# EAGLE design MeshSync (EAGLE 6.1)
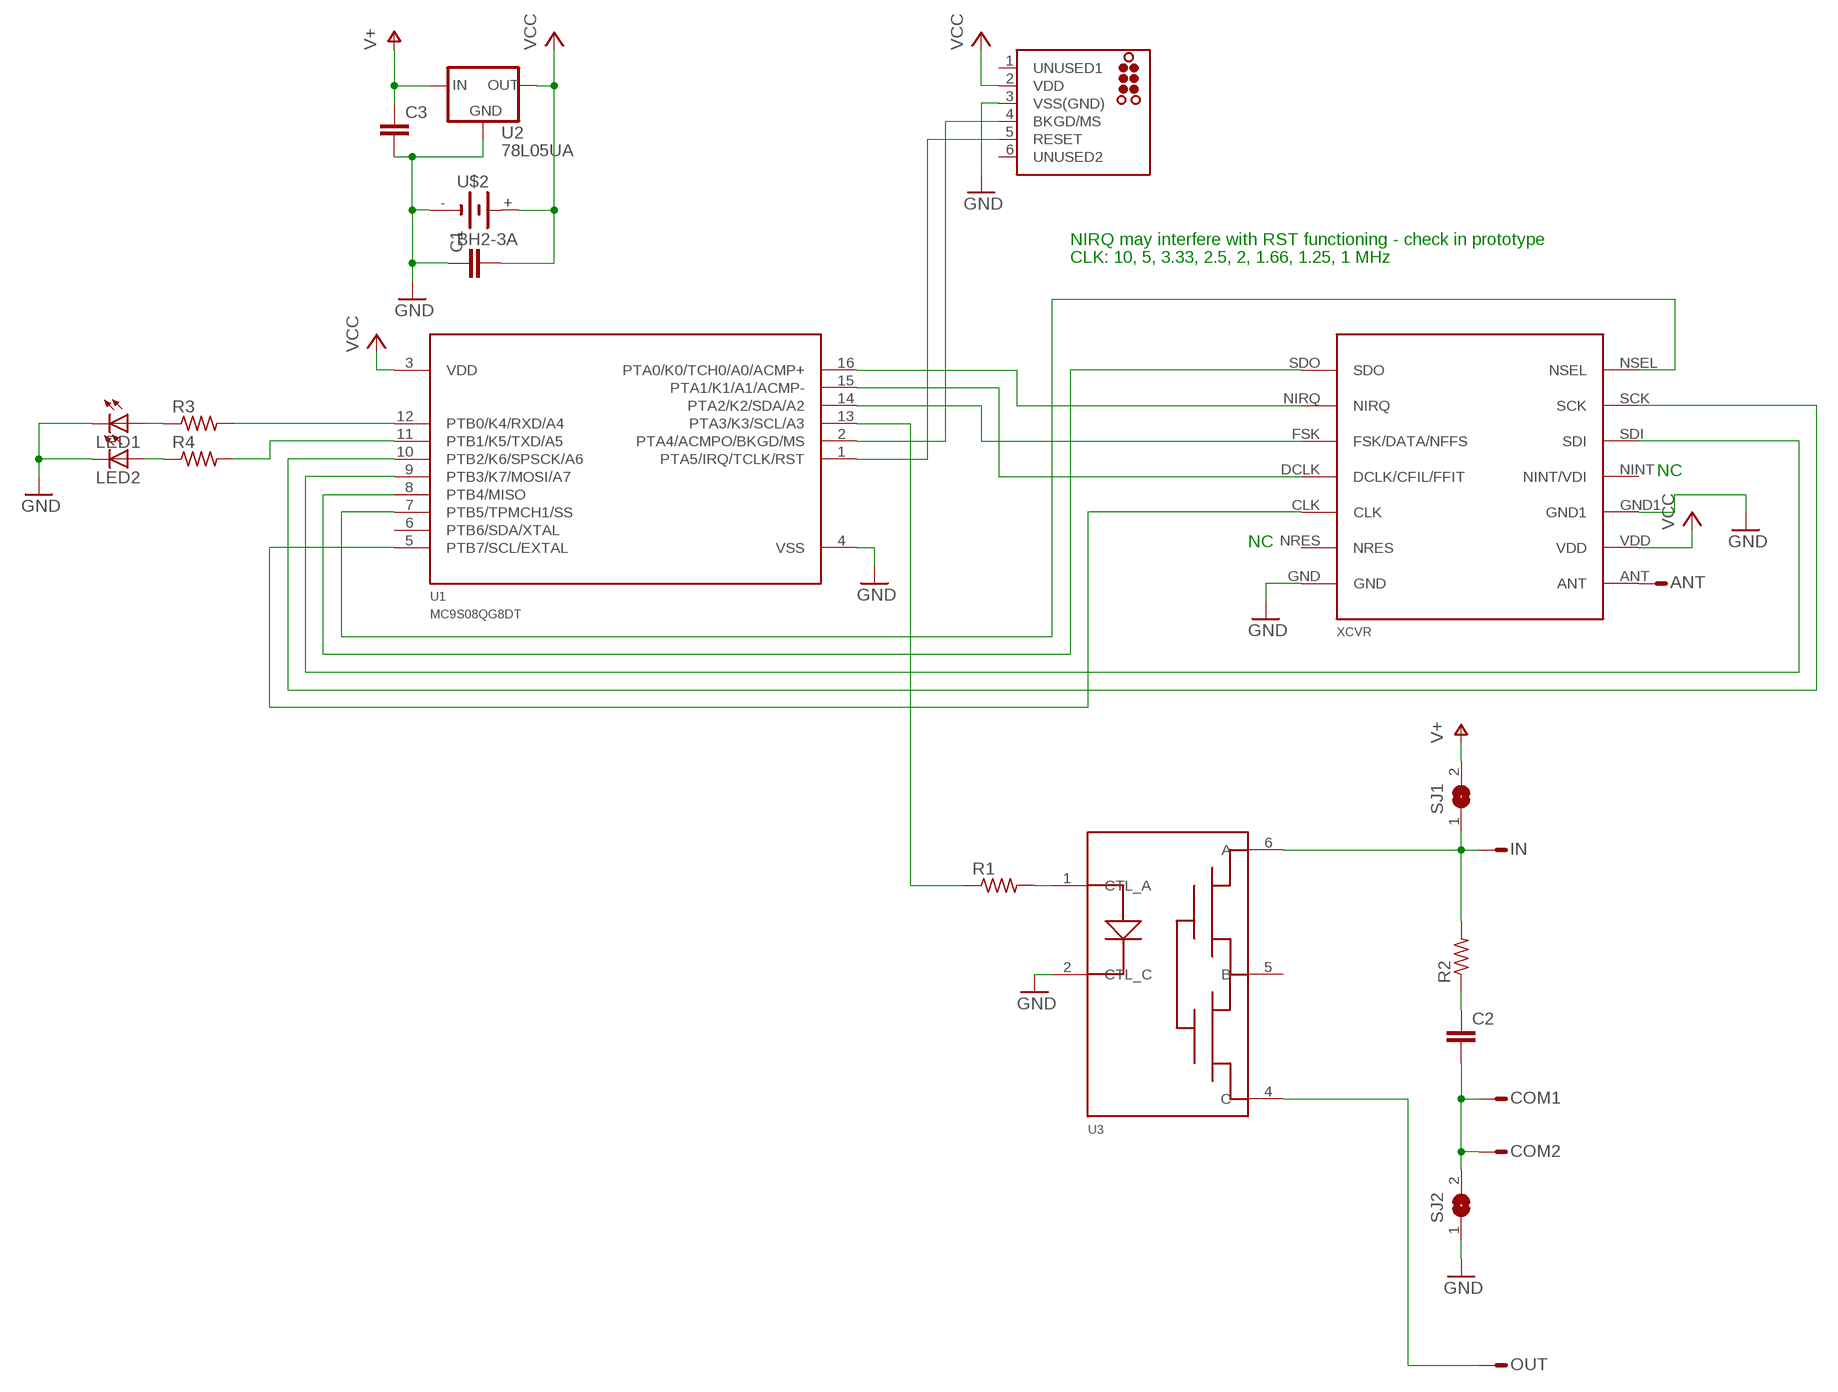
[diagram p0: schematic, sheet 1]

## Parts
ANT  PIN  [PINHEAD-1]
C1  C-EUC0805K  [C0805K]
C2  C-EUC0603K  [C0603K]
C3  C-EUC0603K  [C0603K]
COM1  PIN  [PINHEAD-1]
COM2  PIN  [PINHEAD-1]
IN  PIN  [PINHEAD-1]
LED1  LEDCHIPLED_0603  [CHIPLED_0603]
LED2  LEDCHIPLED_0603  [CHIPLED_0603]
OUT  PIN  [PINHEAD-1]
R1  R0603  [R0603]
R2  R0603  [R0603]
R3  R0603  [R0603]
R4  R0603  [R0603]
SJ1  SJW  [SJW]
SJ2  SJW  [SJW]
U1  MC9S08QG8DT  [TSSOP16]
U2  78L05UA  [SOT89]
U3  PVT312  [DIL06-SMT]
U$1  TC2030-MCP-NL  [TC2030-MCP-NL]
U$2  BH2-3A  [BH2-3A]
XCVR  RFM12B  [RFM12B]

## Nets
GND: C1.1 C3.2 LED1.C LED2.C SJ2.1 U1.4(VSS) U2.2(GND) U3.2(CTL_C) U$1.3(VSS(GND)) U$2.- XCVR.GND XCVR.GND1
N$1: U1.2(PTA4/ACMPO/BKGD/MS) U$1.4(BKGD/MS)
N$2: U1.1(PTA5/IRQ/TCLK/RST) U$1.5(RESET)
N$3: R1.2 U3.1(CTL_A)
N$4: U1.8(PTB4/MISO) XCVR.SDO
N$5: U1.9(PTB3/K7/MOSI/A7) XCVR.SDI
N$6: U1.10(PTB2/K6/SPSCK/A6) XCVR.SCK
N$7: U1.7(PTB5/TPMCH1/SS) XCVR.NSEL
N$8: U1.16(PTA0/K0/TCH0/A0/ACMP+) XCVR.NIRQ
N$9: U1.5(PTB7/SCL/EXTAL) XCVR.CLK
N$10: U1.15(PTA1/K1/A1/ACMP-) XCVR.DCLK(DCLK/CFIL/FFIT)
N$11: U1.14(PTA2/K2/SDA/A2) XCVR.FSK(FSK/DATA/NFFS)
N$12: ANT.1(M) XCVR.ANT
N$13: R1.1 U1.13(PTA3/K3/SCL/A3)
N$14: IN.1(M) R2.2 SJ1.1 U3.6(A)
N$15: OUT.1(M) U3.4(C)
N$16: C2.1 R2.1
N$17: C2.2 COM1.1(M) COM2.1(M) SJ2.2
N$18: R4.2 U1.11(PTB1/K5/TXD/A5)
N$19: R3.2 U1.12(PTB0/K4/RXD/A4)
N$20: LED1.A R3.1
N$21: LED2.A R4.1
V+: C3.1 SJ1.2 U2.3(IN)
VCC: C1.2 U1.3(VDD) U2.1(OUT) U$1.2(VDD) U$2.+ XCVR.VDD
Unconnected: U1.6(PTB6/SDA/XTAL) U3.5(B) U$1.1(UNUSED1) U$1.6(UNUSED2) XCVR.NINT(NINT/VDI) XCVR.NRES

## Notes on the sheet
- NIRQ may interfere with RST functioning - check in prototype
- CLK: 10, 5, 3.33, 2.5, 2, 1.66, 1.25, 1 MHz
- NC
- NC

## Library data of the parts
ANT COM1 COM2 IN OUT = scott:PIN
C1-C3 = rcl:C-EU: CAPACITOR, European symbol
LED1 LED2 = led:LED: LED OSRAM: - CHIPLED LG R971, LG N971, LY N971, LG Q971, LY Q971, LO R971, LY R971 LH N974, LH R974 LS Q976, LO Q976, LY Q976 LO Q996 - Hyper CHIPLED LW Q18S LB Q993, LB Q99A, LB R99A - SideLED LS A670, LO A670, LY A670, LG A670, LP A670 LB A673, LV A673, LT A673, LW A673 LH A674 LY A675 LS A676, LA A676, LO A676, LY A676, LW A676 LS A679, LY A679, LG A679 - Hyper Micro SIDELED® LS Y876, LA Y876, LO Y876, LY Y876 LT Y87S - SmartLED LW L88C, LW L88S LB L89C, LB L89S, LG L890 LS L89K, LO L89K, LY L89K LS L896, LA L896, LO L896, LY L896 - TOPLED LS T670, LO T670, LY T670, LG T670, LP T670 LSG T670, LSP T670, LSY T670, LOP T670, LYG T670 LG T671, LOG T671, LSG T671 LB T673, LV T673, LT T673, LW T673 LH T674 LS T676, LA T676, LO T676, LY T676, LB T676, LH T676, LSB T676, LW T676 LB T67C, LV T67C, LT T67C, LS T67K, LO T67K, LY T67K, LW E67C LS E67B, LA E67B, LO E67B, LY E67B, LB E67C, LV E67C, LT E67C LW T67C LS T679, LY T679, LG T679 LS T770, LO T770, LY T770, LG T770, LP T770 LB T773, LV T773, LT T773, LW T773 LH T774 LS E675, LA E675, LY E675, LS T675 LS T776, LA T776, LO T776, LY T776, LB T776 LHGB T686 LT T68C, LB T68C - Hyper Mini TOPLED® LB M676 - Mini TOPLED Santana® LG M470 LS M47K, LO M47K, LY M47K Source: http://www.osram.convergy.de LUXEON: - LUMILED® LXK2-PW12-R00, LXK2-PW12-S00, LXK2-PW14-U00, LXK2-PW14-V00 LXK2-PM12-R00, LXK2-PM12-S00, LXK2-PM14-U00 LXK2-PE12-Q00, LXK2-PE12-R00, LXK2-PE12-S00, LXK2-PE14-T00, LXK2-PE14-U00 LXK2-PB12-K00, LXK2-PB12-L00, LXK2-PB12-M00, LXK2-PB14-N00, LXK2-PB14-P00, LXK2-PB14-Q00 LXK2-PR12-L00, LXK2-PR12-M00, LXK2-PR14-Q00, LXK2-PR14-R00 LXK2-PD12-Q00, LXK2-PD12-R00, LXK2-PD12-S00 LXK2-PH12-R00, LXK2-PH12-S00 LXK2-PL12-P00, LXK2-PL12-Q00, LXK2-PL12-R00 Source: www.luxeon.com KINGBRIGHT: KA-3528ASYC Source: www.kingbright.com
R1-R4 = scott:R0603
SJ1 SJ2 = jumper:SJ: SMD solder JUMPER
U1 = scott:MC9S08QG8
U2 = scott:78L05
U3 = scott:PVT312
U$1 = scott:TC2030: TAG-CONNECT ISP Connector Manufacturer: Tag-Connect <www.tag-connect.com> Cable for easy In-Circuit PCB Programming. Designed for Microchip ICD2, suitable for many others. Two variants - one "with legs" (for hads-free fit on PCB) and another "without legs" for quick programming. PAD Description 1 MCLR/Vpp 2 Vdd 3 GND 4 PGD (ISPDAT) 5 PGC (ISPCLK) 6 nc (used for LVP) ©2009 ROFA.cz
U$2 = scott:BH2-3A
XCVR = scott:RFM12B: ISM band transceiver. 2.2 to 3.8v supply.

## Board
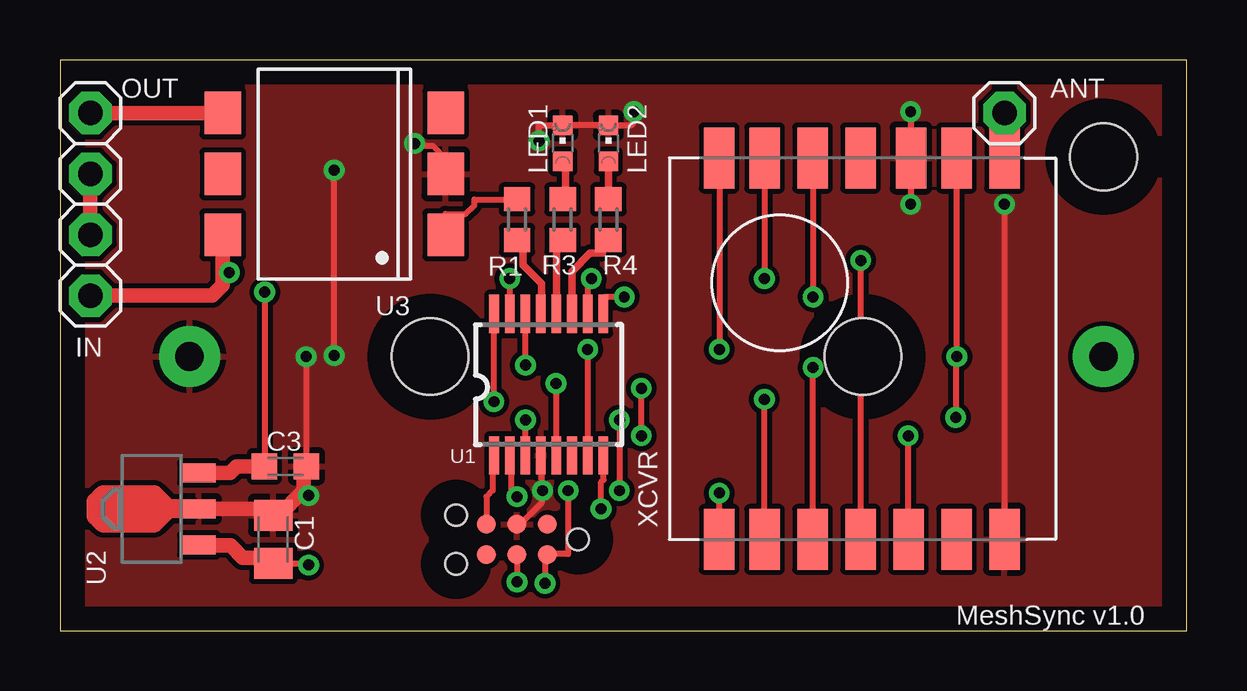
[diagram p1: board, top side]
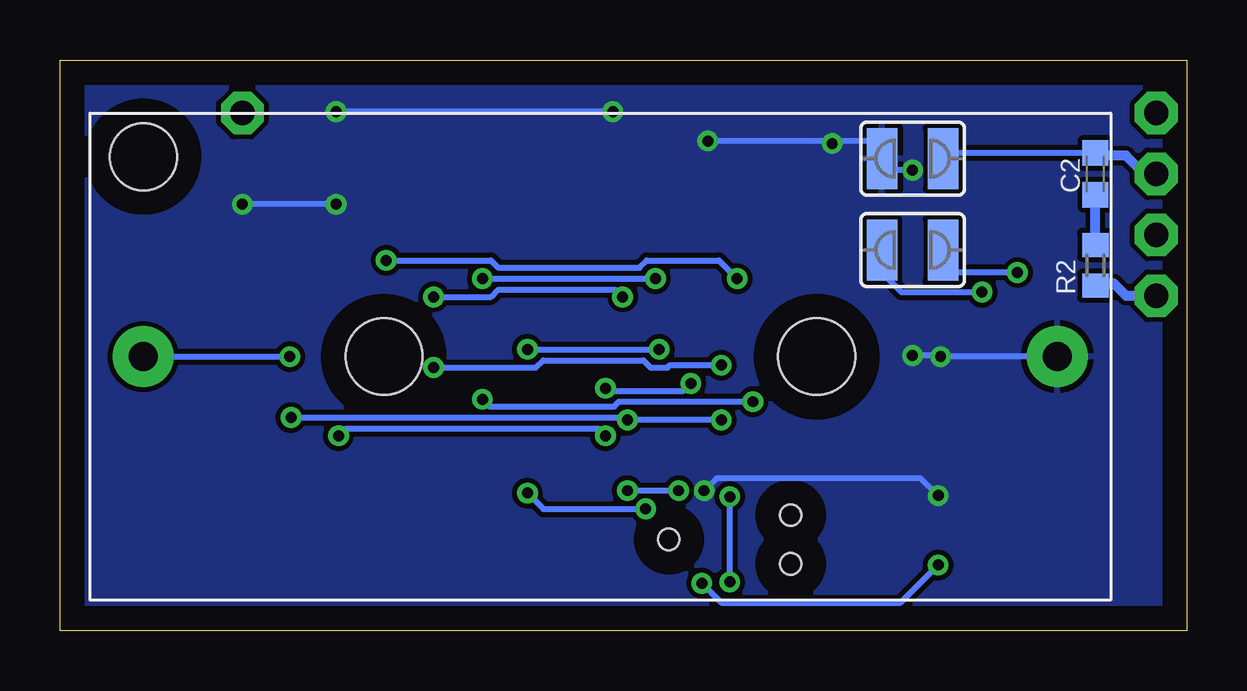
[diagram p2: board, bottom side, seen from below]

Size 46.97 x 23.8 mm. Coordinates in mm from the lower left corner, seen from the top.
Outline: 0,0 46.97,0 46.97,23.8 0,23.8 0,0
Copper layers (1*16): Top 0.035mm / dielectric 1.5mm / Bottom 0.035mm
Design rules: minimum track width 10mil, minimum drill 18mil, track to track 8mil, track to pad 8mil, pad to pad 8mil, via to via 8mil, smd to smd 8mil, copper to edge 40mil, drill to drill 8mil, minimum pad ring 10mil, minimum via ring 8mil, stop-mask expansion 4mil, vias tented up to drill 19mil, thermal gap 10mil

### Footprints (pad centres in the part's own frame; a part is rotated, then mirrored left to right if it is on the bottom)
PINHEAD-1 = drill 1.016 pad 1.778 octagon: 1 0,0
C0805K = smd 1.3 x 1.6: 1 -1,0; 2 1,0
C0603K = smd 1.05 x 1.08: 1 -0.875,0; 2 0.875,0
CHIPLED_0603 = smd 0.8 x 0.8: A 0,-0.75; C 0,0.75
R0603 = smd 1 x 1.1: 1 -0.85,0; 2 0.85,0
SJW = smd 1.27 x 2.54: 1 -1.27,0; 2 1.27,0
TSSOP16 = smd 0.4 x 1.6: 1 -2.225,-2.85; 2 -1.575,-2.85; 3 -0.925,-2.85; 4 -0.275,-2.85; 5 0.375,-2.85; 6 1.025,-2.85; 7 1.675,-2.85; 8 2.325,-2.85; 9 2.325,3.05; 10 1.675,3.05; 11 1.025,3.05; 12 0.375,3.05; 13 -0.275,3.05; 14 -0.925,3.05; 15 -1.575,3.05; 16 -2.225,3.05
SOT89 = smd 0.8 x 1.4: 1 -1.499,-1.981; 2 0,-1.981; 3 1.499,-1.981
DIL06-SMT = smd 1.78 x 1.52: 1 -2.54,-4.645; 2 0,-4.645; 3 2.54,-4.645; 4 2.54,4.645; 5 0,4.645; 6 -2.54,4.645
TC2030-MCP-NL = smd 0.787 x 0.787: 1 1.27,-0.635; 2 1.27,0.635; 3 2.54,-0.635; 4 2.54,0.635; 5 3.81,-0.635; 6 3.81,0.635 | hole 0.889: 0,0; 5.08,-1.016; 5.08,1.016
BH2-3A = drill 1.2 pad 2.54: + 18.098,0; - -20.003,0 | hole 3.2: -9.97,0; 8.065,0 | hole 2.8: 18.098,-8.331
RFM12B = smd 1.27 x 2.54: ANT 13.97,15.9; CLK 9.97,0; DCLK 7.97,0; FSK 5.97,0; GND 13.97,0; GND1 10.07,15.9; NINT 7.97,15.9; NIRQ 3.97,0; NRES 11.97,0; NSEL 2.07,15.9; SCK 3.97,15.9; SDI 5.97,15.9; SDO 2.07,0; VDD 11.97,15.9

### Placement (x,y rotation side)
ANT  39.37,21.59 0 top
C1  8.89,3.81 270 top
C2  3.81,19.05 90 bottom
C3  9.4,6.86 0 top
COM1  1.27,19.05 0 top
COM2  1.27,16.51 0 top
IN  1.27,13.97 0 top
LED1  20.95,20.32 0 top
LED2  22.86,20.32 0 top
OUT  1.27,21.59 0 top
R1  19.05,17.14 90 top
R2  3.81,15.24 270 bottom
R3  20.95,17.14 270 top
R4  22.86,17.14 270 top
SJ1  11.43,15.88 180 bottom
SJ2  11.43,19.68 0 bottom
U1  20.32,10.16 0 top
U2  3.81,5.08 90 top
U3  11.43,19.05 90 top
U$1  21.59,3.81 180 top
U$2  25.4,11.43 180 bottom
XCVR  25.4,3.81 0 top

### Tracks (layer width: path | path; a pad name or v marks a point on that pad's centre or on a via)
GND  (via drill 0.46)
  Top 0.254: U$1.3 19.05,4.32 20.07,5.33 20.07,5.84 | 20.07,5.84 20.07,7.11 U1.4 | v39.37,17.78 XCVR.GND | v35.46,17.78 35.46,19.66 XCVR.GND1 35.46,19.81 v35.46,21.64 | v19.96,20.42 19.96,21.08 20.83,21.08 LED1.C 20.98,21.08 22.86,21.08 LED2.C 22.96,21.08 23.82,21.08 23.88,21.13 23.88,21.59 v23.93,21.64 | v14.78,20.32 14.78,20.22 15.54,20.22 16.05,19.71 16.05,19.05 U3.2 | v20.12,5.84 20.07,5.84 | v10.36,5.64 10.16,5.84 | v10.26,11.43 10.26,7.11 C3.2 | v11.43,11.48 v11.43,19.2
  Top 0.61: U2.2 8.89,5.08 C1.1 9.13,4.81 10.16,5.84 10.16,6.86 C3.2
  Bottom 0.254: v35.46,17.78 v39.37,17.78 | 14.78,20.42 12.75,20.42 12.7,20.37 SJ2.1 12.7,19.2 v11.43,19.2 | 14.78,20.42 v19.96,20.42 | v14.78,20.32 14.78,20.42 | v20.12,5.84 19.61,6.35 11.07,6.35 v10.36,5.64 | U$2.- v10.26,11.43 10.36,11.48 v11.43,11.48 | v23.93,21.64 v35.46,21.64
  pour Top: 0.25,23.62 46.74,23.62 46.74,0.25 0.25,0.25
  pour Bottom: 0.25,23.62 46.74,23.62 46.74,0.25 0.25,0.25
N$1  (via drill 0.46)
  Top 0.254: U1.2 18.8,7.11 18.8,5.59 v19.05,5.59 | U$1.4 v19.05,2.03
  Bottom 0.254: v19.05,2.03 v19.05,5.59
N$2
  Top 0.254: U$1.5 17.78,5.59 18.03,5.84 18.03,7.11 U1.1
N$3
  Top 0.254: R1.2 19.05,17.98 17.27,17.98 17.27,17.73 16.92,17.37 16.05,17.37 16.05,16.51 U3.1
N$4  (via drill 0.46)
  Top 0.254: v22.55,5.08 22.55,6.2 22.66,6.3 22.66,7.26 U1.8 | v27.48,5.74 27.48,3.81 XCVR.SDO
  Bottom 0.254: v22.55,5.08 26.82,5.08 v27.48,5.74
N$5  (via drill 0.46)
  Top 0.254: v23.52,13.92 22.71,13.92 22.66,13.87 22.66,13.26 U1.9 | v31.39,13.92 31.39,19.66 XCVR.SDI
  Bottom 0.254: v23.52,13.92 23.82,14.22 28.7,14.22 29.01,13.92 v31.39,13.92
N$6  (via drill 0.46)
  Top 0.254: v22.15,14.68 22,14.53 22,13.26 U1.10 | v29.36,14.68 29.36,19.66 XCVR.SCK
  Bottom 0.254: v29.36,14.68 v22.15,14.68
N$7  (via drill 0.46)
  Top 0.254: v22,11.73 U1.7 | v27.48,11.73 27.48,19.66 XCVR.NSEL
  Bottom 0.254: v27.48,11.73 v22,11.73
N$8  (via drill 0.46)
  Top 0.254: v18.09,9.55 U1.16 | v29.36,9.65 XCVR.NIRQ
  Bottom 0.254: v18.09,9.55 23.67,9.55 23.88,9.35 29.06,9.35 v29.36,9.65
N$9  (via drill 0.46)
  Top 0.254: v20.68,10.31 20.68,7.32 U1.5 | v24.23,8.13 v24.23,10.11 | v35.36,8.13 35.36,3.81 XCVR.CLK
  Bottom 0.254: v20.68,10.31 20.98,10.01 24.13,10.01 v24.23,10.11 | v24.23,8.13 24.54,8.43 35.05,8.43 v35.36,8.13
N$10  (via drill 0.46)
  Top 0.254: v18.75,14.68 18.75,13.26 U1.15 | v33.38,15.44 XCVR.DCLK
  Bottom 0.254: v18.75,14.68 19.51,15.44 22.5,15.44 22.81,15.14 28.7,15.14 29.01,15.44 v33.38,15.44
N$11  (via drill 0.46)
  Top 0.254: v19.41,11.07 19.41,13.21 U1.14 | v31.39,10.97 31.39,3.81 XCVR.FSK
  Bottom 0.254: v19.41,11.07 21.54,11.07 21.64,10.97 22.35,10.97 22.66,11.28 26.82,11.28 27.13,10.97 v31.39,10.97
N$12
  Top 0.254: XCVR.ANT ANT.1
N$13
  Top 0.305: R1.1 19.05,16.51 19.3,16.26 19.3,15.24 20.07,14.48 20.07,13.46 U1.13
N$14  (via drill 0.46)
  Top 0.254: v7.06,14.94 6.79,14.94
  Top 0.61: U3.6 6.79,14.94 6.79,14.4 6.35,13.97 IN.1
  Bottom 0.254: SJ1.1 10.16,14.94 v7.06,14.94
  Bottom 0.406: IN.1 2.54,13.97 3.05,14.48 3.81,14.48 R2.2
N$15
  Top 0.61: OUT.1 U3.4
N$16
  Bottom 0.406: R2.1 C2.1 3.81,18.29
N$17
  Top 0.61: COM2.1 COM1.1
  Bottom 0.254: SJ2.2 10.16,19.91 3.96,19.91 C2.2
  Bottom 0.406: COM1.1 1.78,19.05 2.54,19.81 3.81,19.81 C2.2
N$18
  Top 0.305: U1.11 21.34,13.46 21.34,14.99 22.1,15.75 22.61,15.75 22.61,16.26 22.86,16.51 R4.2
N$19
  Top 0.305: R3.2 20.7,16.3 U1.12
N$20
  Top 0.305: LED1.A 21.08,19.56 21.08,18.03 R3.1
N$21
  Top 0.305: R4.1 LED2.A
V+  (via drill 0.46)
  Top 0.254: v8.53,14.12 8.53,7.11 C3.1
  Top 0.61: U2.3 7.09,6.58 7.37,6.86 C3.1 8.53,6.86 8.64,6.86
  Bottom 0.254: v8.53,14.12 11.89,14.12 12.7,14.94 SJ1.2
VCC  (via drill 0.46)
  Top 0.254: v21.18,5.84 21.18,3.2 20.32,3.2 U$1.2 20.22,3.1 v20.22,1.98 | v23.32,8.79 v23.32,5.84 | v19.41,8.79 19.41,7.32 U1.3 | v10.36,2.74 10.36,2.79 9.14,2.79 C1.2 | XCVR.VDD 37.39,19.66 v37.39,11.43 37.34,11.33 v37.34,8.89
  Top 0.61: U2.1 5.84,3.56 7.11,3.56 7.62,3.05 8.89,3.05 C1.2
  Bottom 0.254: v23.32,5.84 v21.18,5.84 | v19.41,8.79 v23.32,8.79 23.37,8.89 v37.34,8.89 | v10.36,2.74 11.94,1.17 19.41,1.17 v20.22,1.98 | U$2.+ v37.39,11.43

### Text on the board
tNames: MeshSync v1.0